# Altium schematic sheet 06.SchDoc
size 420 x 297 mm
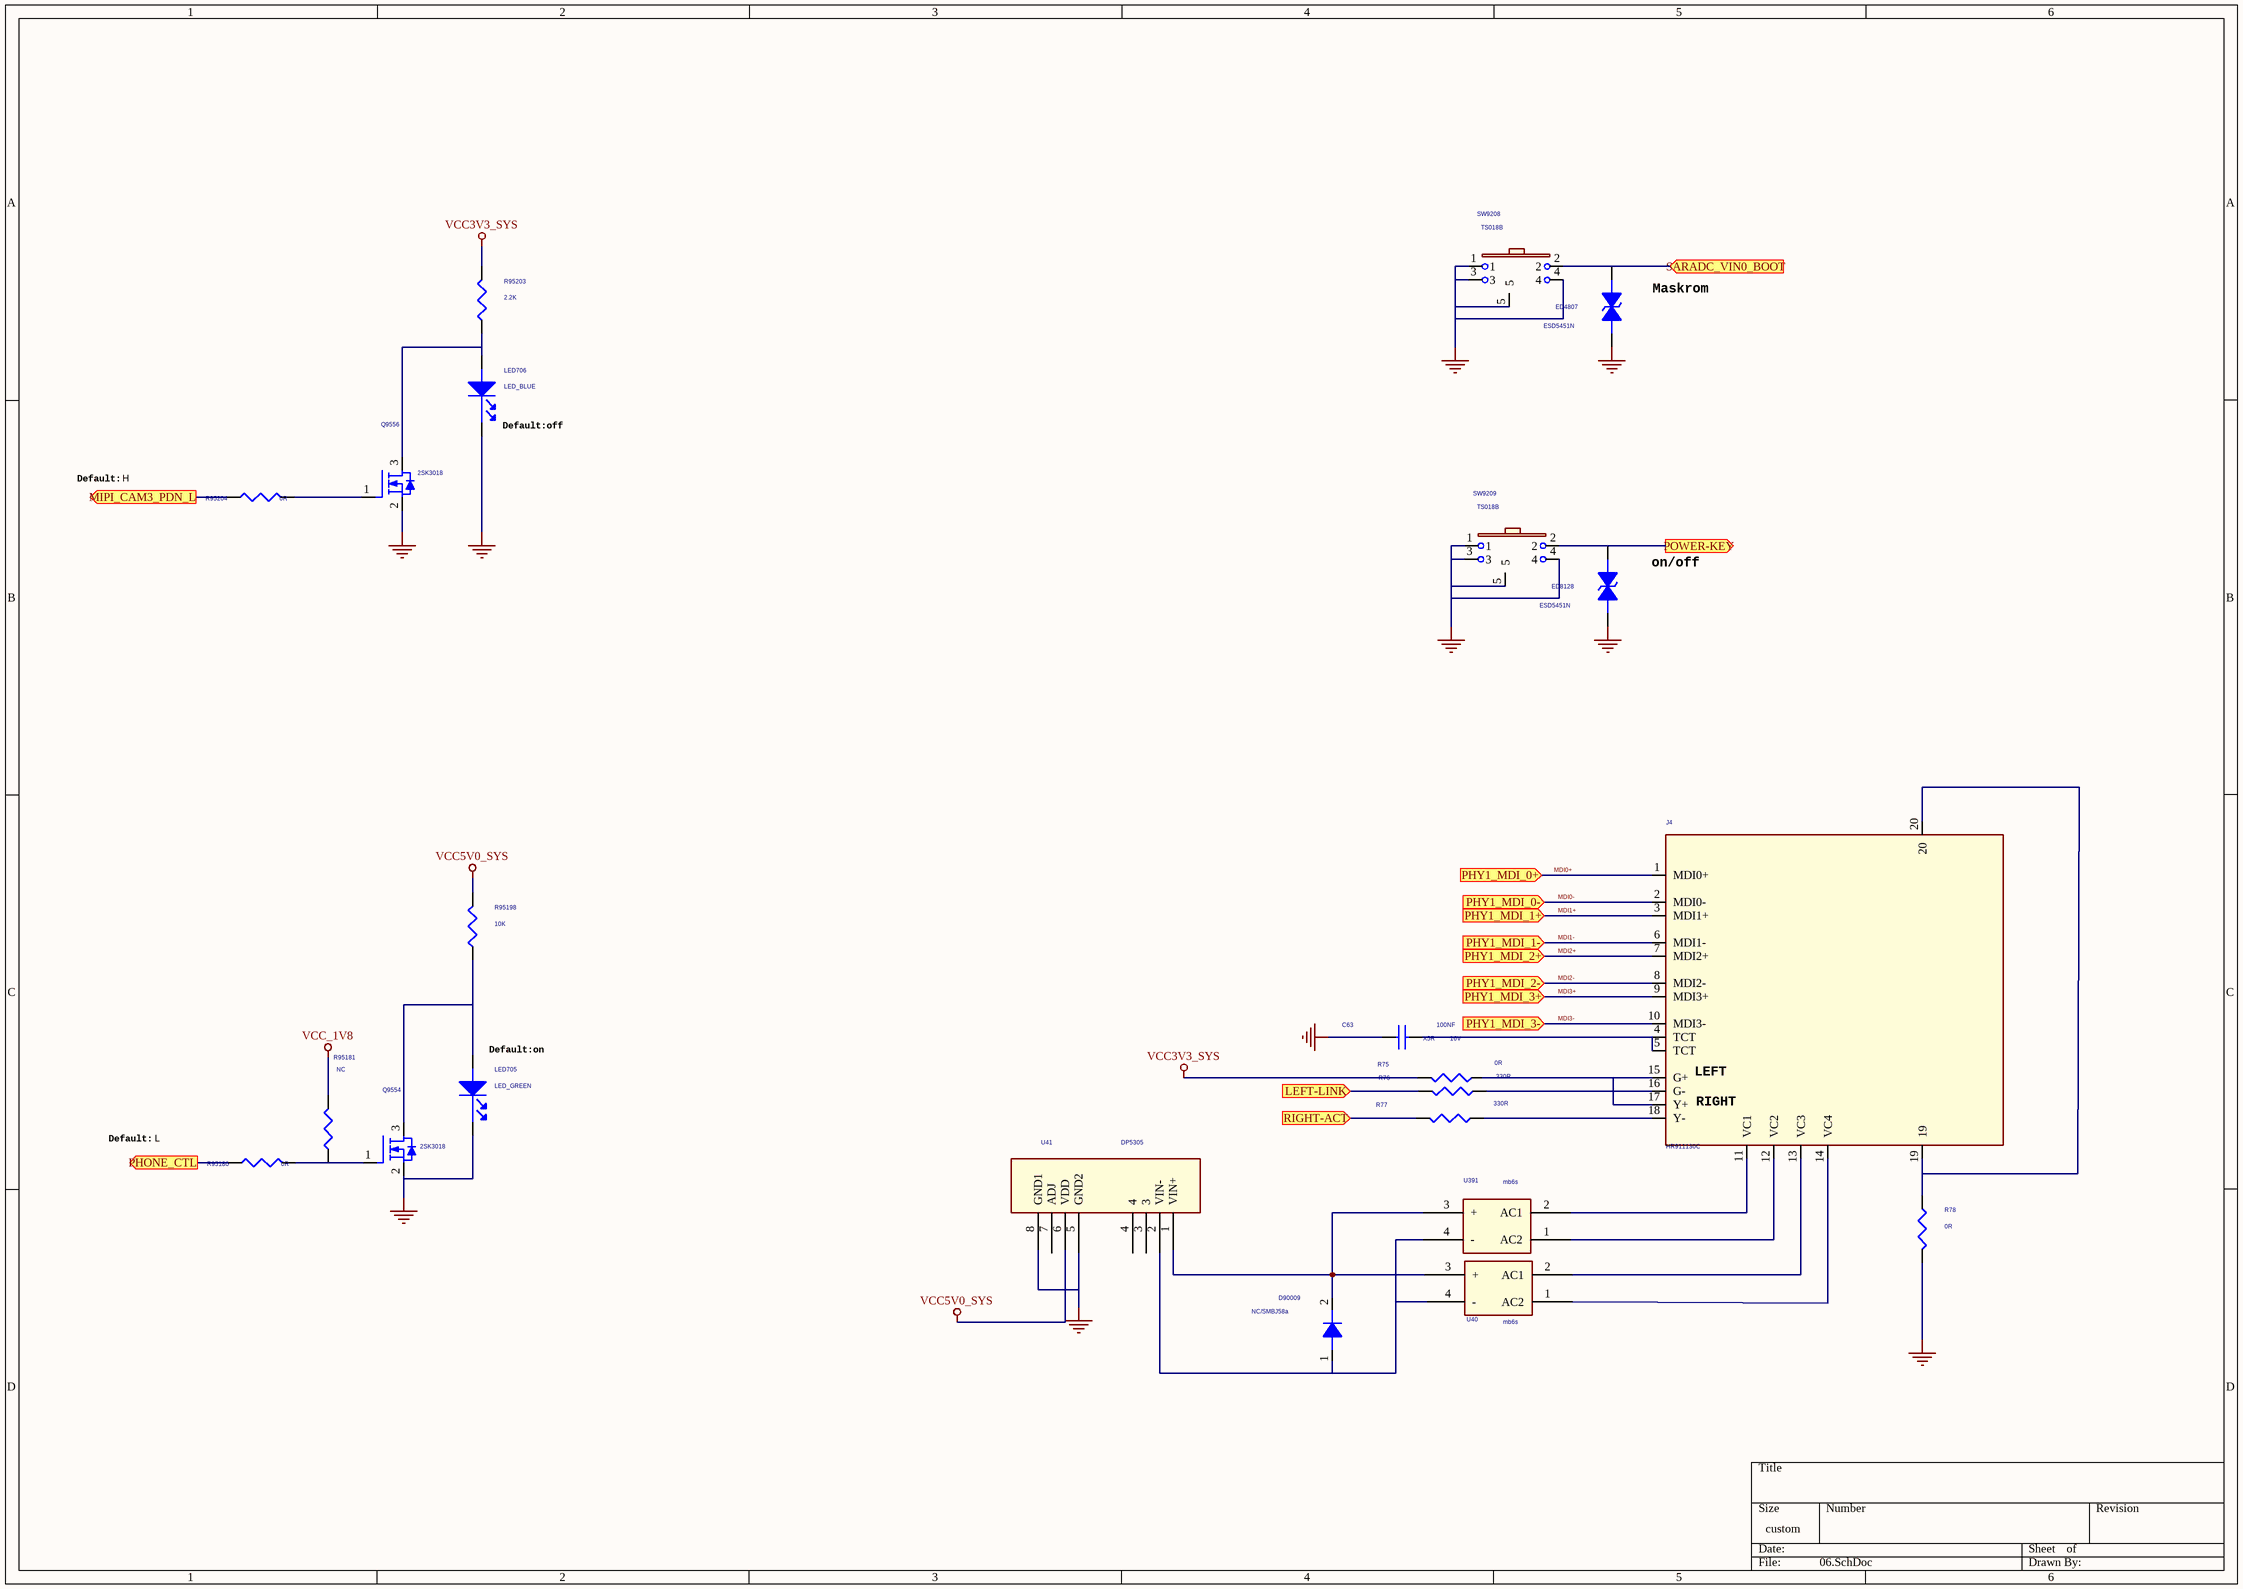
[diagram p0: 06.SchDoc]

## Parts
C63  100NF  Dielectric: X5R  Voltage: 16V  [C0805]
D90009  NC/SMBJ58a  [DO214AA]
ED4807  ESD5451N  [E0402N]
ED8128  ESD5451N  [E0402N]
J4  HR911130C  [RJ45_PULSE]
LED705  LED_GREEN  [LED0603]
LED706  LED_BLUE  [LED0603]
Q9554  2SK3018  [SOT23]
Q9556  2SK3018  [SOT23]
R75  0R  [R0402]
R76  330R  [R0402]
R77  330R  [R0402]
R78  0R  [R0402]
R95180  0R  [R0402]
R95181  NC  [R0402]
R95198  10K  [R0402]
R95203  2.2K  [R0402]
R95204  0R  [R0402]
SW9208  TS018B  [YC-6615B]
SW9209  TS018B  [YC-6615B]
U40  mb6s  [mb6s]
U41  DP5305  [DP5312]
U391  mb6s  [mb6s]

## Ports
LEFT-LINK (in), MIPI_CAM3_PDN_L (out), PHONE_CTL (out), PHY1_MDI_0+ (in), PHY1_MDI_0- (in), PHY1_MDI_1+ (in), PHY1_MDI_1- (in), PHY1_MDI_2+ (in), PHY1_MDI_2- (in), PHY1_MDI_3+ (in), PHY1_MDI_3- (in), POWER-KEY (out), RIGHT-ACT (in), SARADC_VIN0_BOOT (in)

## Nets
GND: C63.1 ED4807.2 ED8128.2 LED705.2(CATHODE) LED706.2(CATHODE) Q9554.2(SOURCE) Q9556.2(SOURCE) R78.1 SW9208.1 SW9208.3 SW9208.4 SW9208.5 SW9209.1 SW9209.3 SW9209.4 SW9209.5 U41.5(GND2) U41.8(GND1)
VCC3V3_SYS: R75.1 R95203.2
VCC5V0_SYS: R95198.2 U41.6(VDD)
VCC_1V8: R95181.2
LEFT-LINK: R76.1 ; port LEFT-LINK
MDI0+: J4.1(MDI0+) ; port PHY1_MDI_0+
MDI0-: J4.2(MDI0-) ; port PHY1_MDI_0-
MDI1+: J4.3(MDI1+) ; port PHY1_MDI_1+
MDI1-: J4.6(MDI1-) ; port PHY1_MDI_1-
MDI2+: J4.7(MDI2+) ; port PHY1_MDI_2+
MDI2-: J4.8(MDI2-) ; port PHY1_MDI_2-
MDI3+: J4.9(MDI3+) ; port PHY1_MDI_3+
MDI3-: J4.10(MDI3-) ; port PHY1_MDI_3-
MIPI_CAM3_PDN_L: R95204.1 ; port MIPI_CAM3_PDN_L
PHONE_CTL: R95180.1 ; port PHONE_CTL
POWER-KEY: ED8128.1 SW9209.2 ; port POWER-KEY
RIGHT-ACT: R77.1 ; port RIGHT-ACT
SARADC_VIN0_BOOT: ED4807.1 SW9208.2 ; port SARADC_VIN0_BOOT
NetC63_2: C63.2 J4.4(TCT) J4.5(TCT)
NetD90009_1: D90009.1(A) U40.4(-) U41.2(VIN-) U391.4(-)
NetD90009_2: D90009.2(K) U40.3(+) U41.1(VIN+) U391.3(+)
NetJ4_11: J4.11(VC1) U391.2(AC1)
NetJ4_12: J4.12(VC2) U391.1(AC2)
NetJ4_13: J4.13(VC3) U40.2(AC1)
NetJ4_14: J4.14(VC4) U40.1(AC2)
NetJ4_15: J4.15(G+) J4.17(Y+) R75.2
NetJ4_16: J4.16(G-) R76.2
NetJ4_18: J4.18(Y-) R77.2
NetJ4_19: J4.19 J4.20 R78.2
NetLED705_1: LED705.1(ANODE) Q9554.3(DRAIN) R95198.1
NetLED706_1: LED706.1(ANODE) Q9556.3(DRAIN) R95203.1
NetQ9554_1: Q9554.1(GATE) R95180.2 R95181.1
NetQ9556_1: Q9556.1(GATE) R95204.2

Not connected (* = marked no-connect by the designer): U41 3 4 7(ADJ)

## Notes on the sheet
- (near ED4807) Maskrom
- (near LED706) Default:off
- Default:Ｈ
- (near ED8128) on/off
- (near LED705) Default:on
- (near J4) LEFT
- (near J4) RIGHT
- Default:Ｌ

## Library data of the parts
C63 = CAP NP_2: cap,100.00nF,+/-10%,16V,X5R,C0402; Manufacturer PN: C1005X5R1C104K050BA; Manufacturer: TDK; Tolerance: 10%; Priority: A; Created by: JJJ; Part Type: C0402; RK PN: C1005X5R1C104K050BA
D90009 = DIODE_Dup2: Schottky Barrier，SS32 DO214AC; Manufacturer PN: SS32; Manufacturer: 星海; Priority: A; Created by: JJJ; Part Type: Schottky rectifier; RK PN: SS32
ED4807 = TVS: ESD Component,5V,30P,SMD,0402; BOM_TYPE: 40; BOM_VALUE: 0
ED8128 = TVS: ESD Component,5V,30P,SMD,0402; BOM_VALUE: 0; BOM_TYPE: 40
J4 = HR911130C_0: 千兆网口接口，内置变压器; VAL: J00-0061; DESIG: 10/100 base TX LXT971A; BOI: RJ45; FAB: PULSE; DEV: CON_PULSE_J00-61; Priority: A; REF: J00-0061; Created by: JJJ; Manufacturer Part Number: HR911130C; Part Type: Ethernet Jack; RK PN: HR911130C
LED705 = LED: 贴片LED灯，0603，绿色; Priority: A; RK PN: LED_GREEN; Part Type: LED; Created by: JJJ
LED706 = LED: 贴片LED灯，0603，绿色; Priority: A; RK PN: LED_GREEN; Created by: JJJ; Part Type: LED
Q9554 = MOSFET N_0: NMOS,2SK3018,SOT_323,Id=0.1A,Vds=30V; Manufacturer: ROHM; Pd: 0.2W; Vgsth: 1.5V; VDS: 30V; Vgs: 20V; Id_max: 0.1A; Priority: A; Rds: 5ohm; Created by: JJJ; Manufacturer PN: 2SK3018; Part Type: NMOS; RK PN: 2SK3018
Q9556 = MOSFET N_0: NMOS,2SK3018,SOT_323,Id=0.1A,Vds=30V; Manufacturer: ROHM; Rds: 5ohm; Priority: A; Id_max: 0.1A; Vgs: 20V; VDS: 30V; Vgsth: 1.5V; Pd: 0.2W; RK PN: 2SK3018; Part Type: NMOS; Manufacturer PN: 2SK3018; Created by: JJJ
R75-R78 = RESISTOR_3: 通用厚膜电阻,100K,+/-5%,R0402,1/16W.; Manufacturer PN: RC0402JR-07100KL; Manufacturer: YAGEO; Tolerance: 5%; Wattage: 1/16W; Priority: A; Created by: YTL; Part Type: 通用厚膜电阻; RK PN: RC0402JR-07100KL
R95180 = RESISTOR_3: 通用厚膜电阻,4K7,+/-1%,R0402,1/16W.; Manufacturer: YAGEO; Tolerance: 1%; RK PN: RC0402FR-074K7L; Priority: A; Wattage: 1/16W; Part Type: 通用厚膜电阻; Manufacturer PN: RC0402FR-074K7L; Created by: YTL
R95181 R95198 R95203 = R_2
R95204 = RESISTOR_3: 通用厚膜电阻,4K7,+/-1%,R0402,1/16W.; Manufacturer PN: RC0402FR-074K7L; Manufacturer: YAGEO; Tolerance: 1%; Wattage: 1/16W; Priority: A; Created by: YTL; Part Type: 通用厚膜电阻; RK PN: RC0402FR-074K7L
SW9208 = KEY_6: 按键，5mm*5mm，直按，插焊; Manufacturer Part Number: KEY_5X5; Manufacturer: 旺科达; Priority: A; Created by: JJJ; Part Type: KEY; RK PN: KEY_5X5
SW9209 = KEY_6: 按键，5mm*5mm，直按，插焊; Manufacturer: 旺科达; RK PN: KEY_5X5; Priority: A; Part Type: KEY; Manufacturer Part Number: KEY_5X5; Created by: JJJ
U41 = DP5312